# Altium schematic sheet whirlygig.SchDoc
size A4
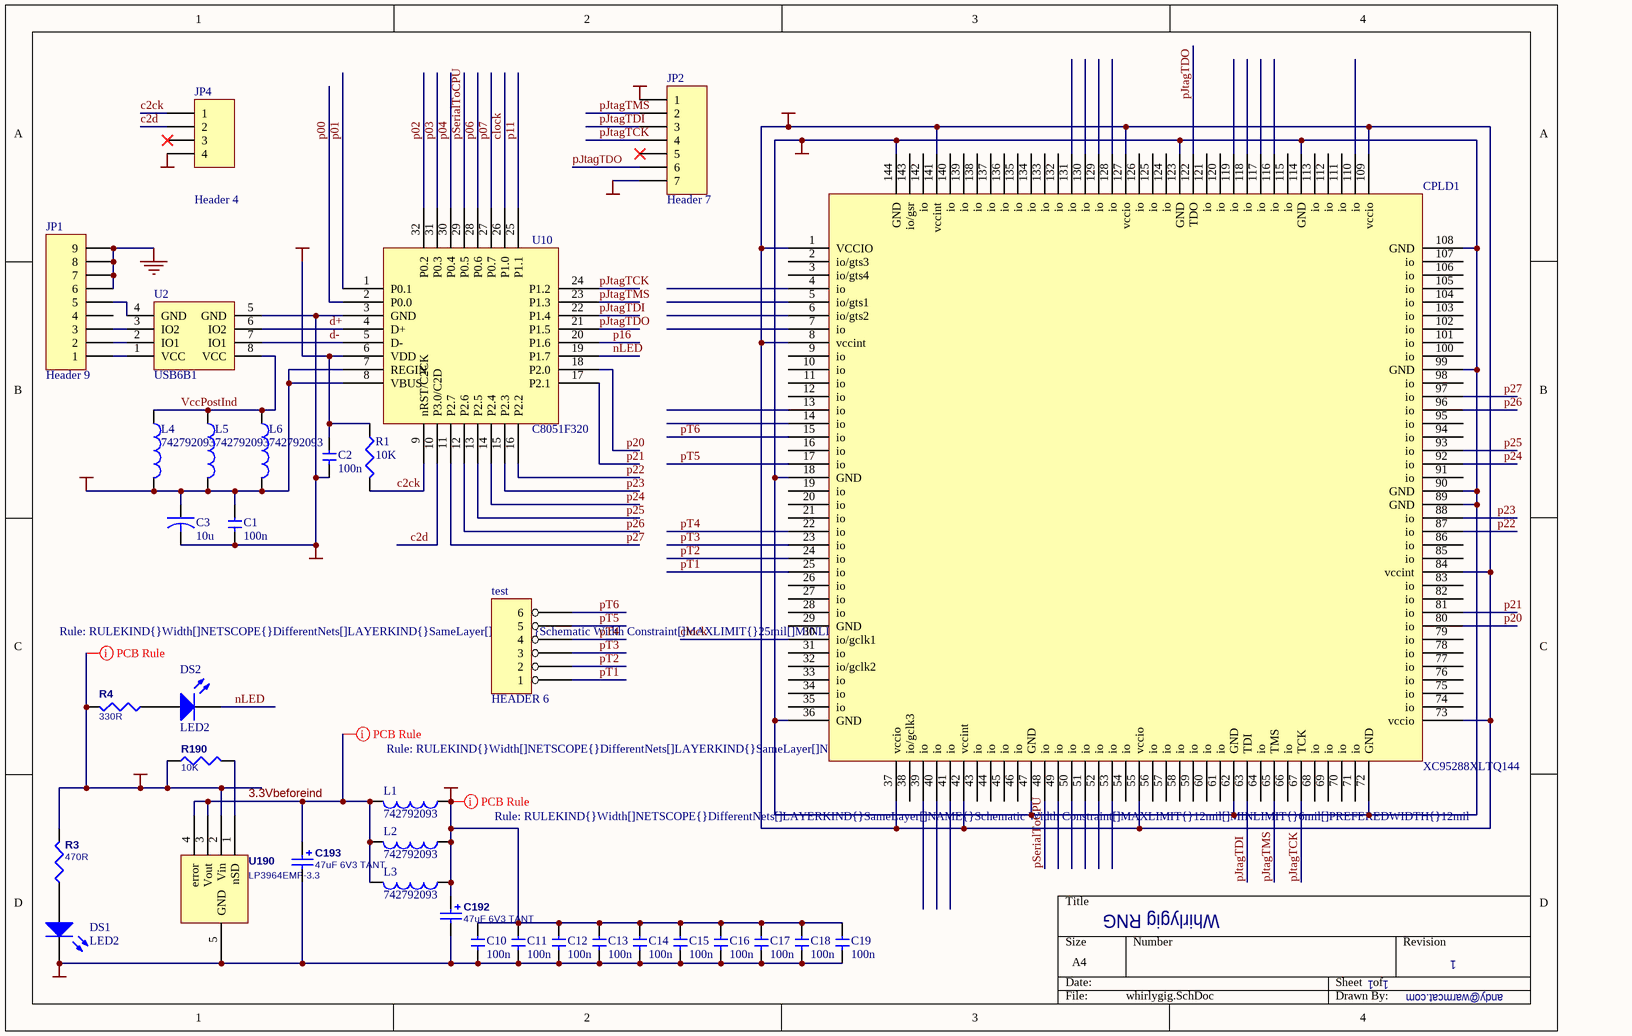
[diagram p0: whirlygig.SchDoc]

## Parts
C1  100n  [C0603]
C2  100n  [C0603]
C3  10u  [TAJ-T]
C10  100n  [C0603]
C11  100n  [C0603]
C12  100n  [C0603]
C13  100n  [C0603]
C14  100n  [C0603]
C15  100n  [C0603]
C16  100n  [C0603]
C17  100n  [C0603]
C18  100n  [C0603]
C19  100n  [C0603]
C192  47uF 6V3 TANT  [TAJ-T]
C193  47uF 6V3 TANT  [TAJ-T]
CPLD1  XC95288XLTQ144  [TQFP144]
DS1  LED2  [DSO-F2/D6.1]
DS2  LED2  [DSO-F2/D6.1]
JP1  Header 9  [USBSKT5MIN]
JP2  Header 7  [HDR1X7]
JP4  Header 4  [HDR1X4]
L1  742792093  [C0805]
L2  742792093  [C0805]
L3  742792093  [C0805]
L4  742792093  [C0805]
L5  742792093  [C0805]
L6  742792093  [C0805]
R1  10K  [R0603]
R3  470R  [R0603]
R4  330R  [R0603]
R190  10K  [R0603]
test  HEADER 6  [HDR1X6]
U2  USB6B1  [SOP8USB]
U10  C8051F320  [LQFP32]
U190  LP3964EMP-3.3  [SOT-223-5]

## Nets
3.3V: C10.1 C11.1 C12.1 C13.1 C14.1 C15.1 C16.1 C17.1 C18.1 C19.1 C192.1 CPLD1.1(VCCIO) CPLD1.8(vccint) CPLD1.37(vccio) CPLD1.42(vccint) CPLD1.55(vccio) CPLD1.73(vccio) CPLD1.84(vccint) CPLD1.109(vccio) CPLD1.127(vccio) CPLD1.141(vccint) JP2.1 L1.1 L2.1 L3.1
3V: C2.1 R1.1 U10.6(VDD)
GND: C1.2 C2.2 C3.2 C10.2 C11.2 C12.2 C13.2 C14.2 C15.2 C16.2 C17.2 C18.2 C19.2 C192.2 C193.2 CPLD1.18(GND) CPLD1.36(GND) CPLD1.47(GND) CPLD1.62(GND) CPLD1.72(GND) CPLD1.89(GND) CPLD1.90(GND) CPLD1.99(GND) CPLD1.108(GND) CPLD1.114(GND) CPLD1.123(GND) CPLD1.144(GND) DS1.2(K) JP2.7 JP4.4 U2.5(GND) U10.3(GND) U190.5(GND)
SHIELD: JP1.6 JP1.7 JP1.8 JP1.9
VBUSIN: C1.1 C3.1 L4.2 L5.2 L6.2 R3.1 R4.1 R190.2 U10.7(REGIN) U10.8(VBUS) U190.2(Vin)
3.3Vbeforeind: C193.1 L1.2 L2.2 L3.2 U190.3(Vout) U190.4(error)
c2ck: JP4.1 R1.2 U10.9(nRST/C2CK)
c2d: JP4.2 U10.10(P3.0/C2D)
clock: CPLD1.30(io/gclk1) U10.26(P1.0)
d+: U2.6(IO2) U10.4(D+)
d-: U2.7(IO1) U10.5(D-)
nLED: DS2.2(K) U10.19(P1.7)
p00: U10.2(P0.0)
p01: U10.1(P0.1)
p02: U10.32(P0.2)
p03: U10.31(P0.3)
p04: U10.30(P0.4)
p06: U10.28(P0.6)
p07: U10.27(P0.7)
p11: U10.25(P1.1)
p16: U10.20(P1.6)
p20: CPLD1.80(io) U10.18(P2.0)
p21: CPLD1.81(io) U10.17(P2.1)
p22: CPLD1.87(io) U10.16(P2.2)
p23: CPLD1.88(io) U10.15(P2.3)
p24: CPLD1.92(io) U10.14(P2.4)
p25: CPLD1.93(io) U10.13(P2.5)
p26: CPLD1.96(io) U10.12(P2.6)
p27: CPLD1.97(io) U10.11(P2.7)
pJtagTCK: CPLD1.67(TCK) JP2.4 U10.24(P1.2)
pJtagTDI: CPLD1.63(TDI) JP2.3 U10.22(P1.4)
pJtagTDO: CPLD1.122(TDO) JP2.6 U10.21(P1.5)
pJtagTMS: CPLD1.65(TMS) JP2.2 U10.23(P1.3)
pSerialToCPU: CPLD1.48(io) U10.29(P0.5)
pT1: CPLD1.25(io) test.1
pT2: CPLD1.24(io) test.2
pT3: CPLD1.23(io) test.3
pT4: CPLD1.22(io) test.4
pT5: CPLD1.17(io) test.5
pT6: CPLD1.15(io) test.6
VccPostInd: L4.1 L5.1 L6.1 U2.8(VCC)
NetDS1_1: DS1.1(A) R3.2
NetDS2_1: DS2.1(A) R4.2
NetJP1_1: JP1.1 U2.1(VCC)
NetJP1_2: JP1.2 U2.2(IO1)
NetJP1_3: JP1.3 U2.3(IO2)
NetJP1_5: JP1.5 U2.4(GND)
NetR190_1: R190.1 U190.1(nSD)

Not connected (* = marked no-connect by the designer): CPLD1 2(io/gts3) 3(io/gts4) 4(io) 5(io/gts1) 6(io/gts2) 7(io) 9(io) 10(io) 11(io) 12(io) 13(io) 14(io) 16(io) 19(io) 20(io) 21(io) 26(io) 27(io) 28(io) 29(GND) 31(io) 32(io/gclk2) 33(io) 34(io) 35(io) 38(io/gclk3) 39(io) 40(io) 41(io) 43(io) 44(io) 45(io) 46(io) 49(io) 50(io) 51(io) 52(io) 53(io) 54(io) 56(io) 57(io) 58(io) 59(io) 60(io) 61(io) 64(io) 66(io) 68(io) 69(io) 70(io) 71(io) 74(io) 75(io) 76(io) 77(io) 78(io) 79(io) 82(io) 83(io) 85(io) 86(io) 91(io) 94(io) 95(io) 98(io) 100(io) 101(io) 102(io) 103(io) 104(io) 105(io) 106(io) 107(io) 110(io) 111(io) 112(io) 113(io) 115(io) 116(io) 117(io) 118(io) 119(io) 120(io) 121(io) 124(io) 125(io) 126(io) 128(io) 129(io) 130(io) 131(io) 132(io) 133(io) 134(io) 135(io) 136(io) 137(io) 138(io) 139(io) 140(io) 142(io) 143(io/gsr); JP1 4; JP2 5*; JP4 3*

## Layout directives
rule Width Constraint [Pref Width = 25mil    Min Width = 6mil    Max Width = 25mil]: VBUSIN
rule Width Constraint [Pref Width = 12mil    Min Width = 6mil    Max Width = 12mil]: 3.3V, 3.3Vbeforeind

## Notes on the sheet
- Whirlygig RNG
- 1   1
- 1
- andy@warmcat.com

## Library data of the parts
C1 C2 C10-C19 = 100N DISK
C3 = 1UF TANT
C192 C193 = Cap Pol3: Polarized Capacitor (Surface Mount); Order: Farnell 1135071; Published: 8-Jun-2000; Revision: July-2002: Re-released for DXP Platform.; Publisher: Altium Limited
DS1 DS2 = LED2: Typical RED, GREEN, YELLOW, AMBER GaAs LED; Published: 8-Jun-2000; LatestRevisionDate: 17-Jul-2002; LatestRevisionNote: Re-released for DXP Platform.; PackageDocument: Feb-2002; PackageReference: 3.2X1.6X1.1; Publisher: Altium Limited
JP1 = Header 9: Header, 9-Pin; LatestRevisionDate: 17-Jul-2002; LatestRevisionNote: Re-released for DXP Platform.; Publisher: Altium Limited
JP2 = Header 7: Header, 7-Pin; LatestRevisionDate: 17-Jul-2002; LatestRevisionNote: Re-released for DXP Platform.; Publisher: Altium Limited
JP4 = Header 4: Header, 4-Pin; LatestRevisionDate: 17-Jul-2002; LatestRevisionNote: Re-released for DXP Platform.; Publisher: Altium Limited
L1-L6 = Inductor: Value: 10mH; Published: 8-Jun-2000; Revision: July-2002: Re-released for DXP Platform.; Publisher: Altium Limited
R1 = 100K: Resistor
R3 R4 = Res3: Resistor; Value: 10K; Published: 8-Jun-2000; Revision: July-2002: Re-released for DXP Platform.; Publisher: Altium Limited
R190 = Res3: Resistor; Published: 8-Jun-2000; Revision: July-2002: Re-released for DXP Platform.; Publisher: Altium Limited; Value: 10K
U2 = USB6B1: USB Protection Diodes
U10 = Component_3: Cygnal USB flash chip
U190 = LP3964